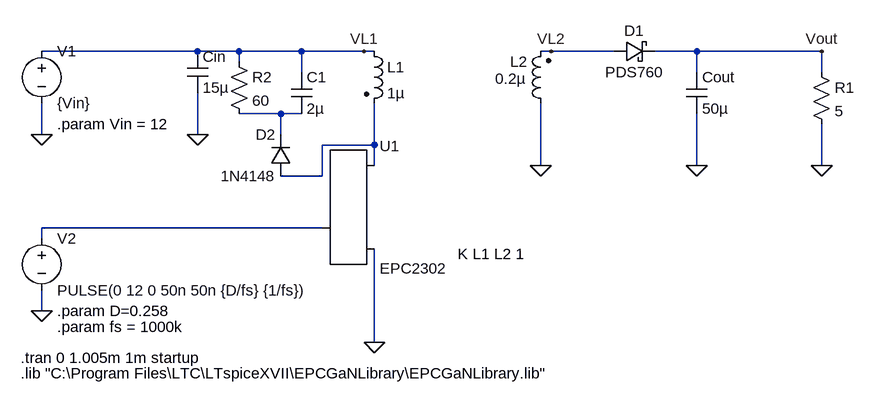
[diagram p0: schematic Flyback_Converter_with_GaN,EPC2066, with Snubber.asc]
Flyback_Converter_with_GaN,EPC2066, with Snubber.asc, the LTspice schematic file:
Version 4
SHEET 1 880 680
WIRE -352 -288 -592 -288
WIRE -288 -288 -352 -288
WIRE -192 -288 -288 -288
WIRE -96 -288 -192 -288
WIRE -80 -288 -96 -288
WIRE 192 -288 176 -288
WIRE 288 -288 192 -288
WIRE 416 -288 352 -288
WIRE 608 -288 416 -288
WIRE -288 -272 -288 -288
WIRE -192 -256 -192 -288
WIRE 416 -256 416 -288
WIRE 608 -256 608 -288
WIRE -224 -192 -288 -192
WIRE -192 -192 -224 -192
WIRE -592 -160 -592 -208
WIRE -352 -160 -352 -224
WIRE -224 -160 -224 -192
WIRE -80 -144 -80 -208
WIRE -80 -144 -160 -144
WIRE -80 -112 -80 -144
WIRE 176 -112 176 -208
WIRE 416 -112 416 -192
WIRE 608 -112 608 -176
WIRE -160 -96 -160 -144
WIRE -160 -96 -224 -96
WIRE -160 -16 -592 -16
WIRE -592 0 -592 -16
WIRE -592 112 -592 80
WIRE -80 160 -80 16
FLAG 176 -112 0
FLAG 416 -112 0
FLAG 608 -112 0
FLAG -80 160 0
FLAG -592 112 0
FLAG -592 -160 0
FLAG 608 -288 Vout
FLAG -96 -288 VL1
FLAG 192 -288 VL2
FLAG -352 -160 0
SYMBOL ind2 -96 -304 R0
SYMATTR InstName L1
SYMATTR Value 1µ
SYMBOL ind2 192 -192 R180
WINDOW 0 36 80 Left 2
WINDOW 3 39 54 Left 2
SYMATTR InstName L2
SYMATTR Value 0.2µ
SYMBOL voltage -592 -304 R0
WINDOW 123 0 0 Left 0
WINDOW 39 24 44 Left 2
SYMATTR InstName V1
SYMATTR Value {Vin}
SYMBOL voltage -592 -16 R0
WINDOW 123 0 0 Left 0
WINDOW 39 0 0 Left 0
SYMATTR InstName V2
SYMATTR Value PULSE(0 12 0 50n 50n {D/fs} {1/fs})
SYMBOL schottky 288 -272 R270
WINDOW 0 32 32 VTop 2
WINDOW 3 0 32 VBottom 2
SYMATTR InstName D1
SYMATTR Value PDS760
SYMATTR Description Diode
SYMATTR Type diode
SYMBOL cap 400 -256 R0
SYMATTR InstName Cout
SYMATTR Value 50µ
SYMBOL res 592 -272 R0
SYMATTR InstName R1
SYMATTR Value 5
SYMBOL EPCGaN -160 -16 R0
SYMATTR InstName U1
SYMATTR Value EPC2302
SYMBOL diode -208 -96 R180
WINDOW 0 24 64 Left 2
WINDOW 3 24 0 Left 2
SYMATTR InstName D2
SYMATTR Value 1N4148
SYMBOL res -304 -288 R0
SYMATTR InstName R2
SYMATTR Value 60
SYMBOL cap -208 -256 R0
SYMATTR InstName C1
SYMATTR Value 2µ
SYMBOL cap -368 -288 R0
SYMATTR InstName Cin
SYMATTR Value 15µ
TEXT 48 24 Left 2 !K L1 L2 1
TEXT -568 112 Left 2 !.param D=0.258
TEXT -568 -176 Left 2 !.param Vin = 12
TEXT -568 136 Left 2 !.param fs = 1000k
TEXT -624 184 Left 2 !.tran 0 1.005m 1m startup
TEXT -624 208 Left 2 !.lib "C:\\Program Files\\LTC\\LTspiceXVII\\EPCGaNLibrary\\EPCGaNLibrary.lib"

The netlist it stands for:
* Flyback_Converter_with_GaN,EPC2066, with Snubber.asc
L1 VL1 N002 1µ
L2 0 VL2 0.2µ
V1 VL1 0 {Vin}
V2 N003 0 PULSE(0 12 0 50n 50n {D/fs} {1/fs})
D1 VL2 Vout PDS760
Cout Vout 0 50µ
R1 Vout 0 5
XU1 N003 N002 0 EPC2302
D2 N002 N001 1N4148
R2 VL1 N001 60
C1 VL1 N001 2µ
Cin VL1 0 15µ
.model D D
.lib standard.dio
K L1 L2 1
.param D=0.258
.param Vin = 12
.param fs = 1000k
.tran 0 1.005m 1m startup
.lib "C:\Program Files\LTC\LTspiceXVII\EPCGaNLibrary\EPCGaNLibrary.lib"
.backanno
.end